# Altium schematic sheet AUTO_PROGRAMMING.SchDoc
size A; SheetNumber: 5; SheetTotal: 8
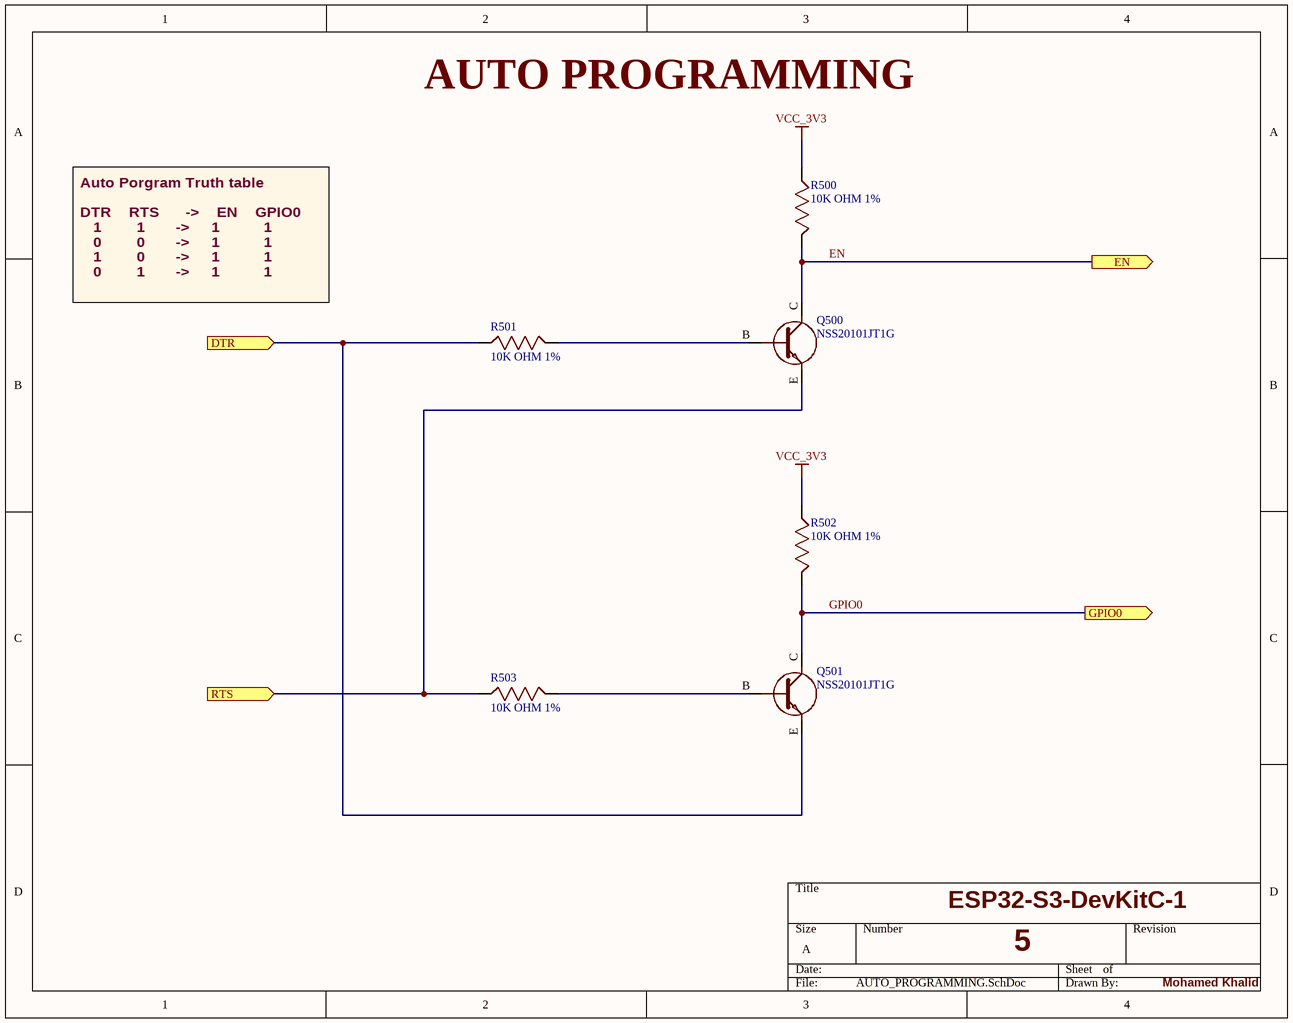
[diagram p0: AUTO_PROGRAMMING.SchDoc]

## Parts
Q500  NSS20101JT1G  [SOTFL50P160X80-3N]
Q501  NSS20101JT1G  [SOTFL50P160X80-3N]
R500  10K OHM 1%  [RESC2012X65N]
R501  10K OHM 1%  [RESC2012X65N]
R502  10K OHM 1%  [RESC2012X65N]
R503  10K OHM 1%  [RESC2012X65N]

## Ports
DTR (in, see USB_TO_UART_CONVERTER[4A]), EN (out, see ESP32-S3-WROOM-1U[2B], PIN-HEADERS[2A], POWER[2C]), GPIO0 (out, see ESP32-S3-WROOM-1U[3C], PIN-HEADERS[3B], POWER[3C]), RTS (in, see USB_TO_UART_CONVERTER[4A])

## Nets
VCC_3V3: R500.2 R502.2
DTR: Q501.E R501.2 ; port DTR
EN: Q500.C R500.1 ; port EN
GPIO0: Q501.C R502.1 ; port GPIO0
RTS: Q500.E R503.2 ; port RTS
NetQ500_B: Q500.B R501.1
NetQ501_B: Q501.B R503.1

## Notes on the sheet
- AUTO PROGRAMMING
- Auto Porgram Truth table
  DTR    RTS      ->    EN    GPIO0
  1        1       ->     1          1
  0        0       ->     1          1
  1        0       ->     1          1
  0        1       ->     1          1
- ESP32-S3-DevKitC-1
- 5
- Mohamed Khalid

## Library data of the parts
Q500 Q501 = NSS20101JT1G: Bipolar Transistors - BJT 20V NPN LOW VCE(SAT); Collector-Emitter Voltage: 20; Collector-Base Voltage: 40; Emitter-Base Voltage: 6.0; Collector Current − Continuous: 1.0
R500-R503 = RMCF0805FT10K0: 10 kOhms ±1% 0.125W, 1/8W Chip Resistor 0805 (2012 Metric) Automotive AEC-Q200 Thick Film; Value: 10 kOhms; Tolerance: ±1%; Power (Watts): 1/8W